# Altium project HGD_MCU(v0.1)-20200807.PrjPcb
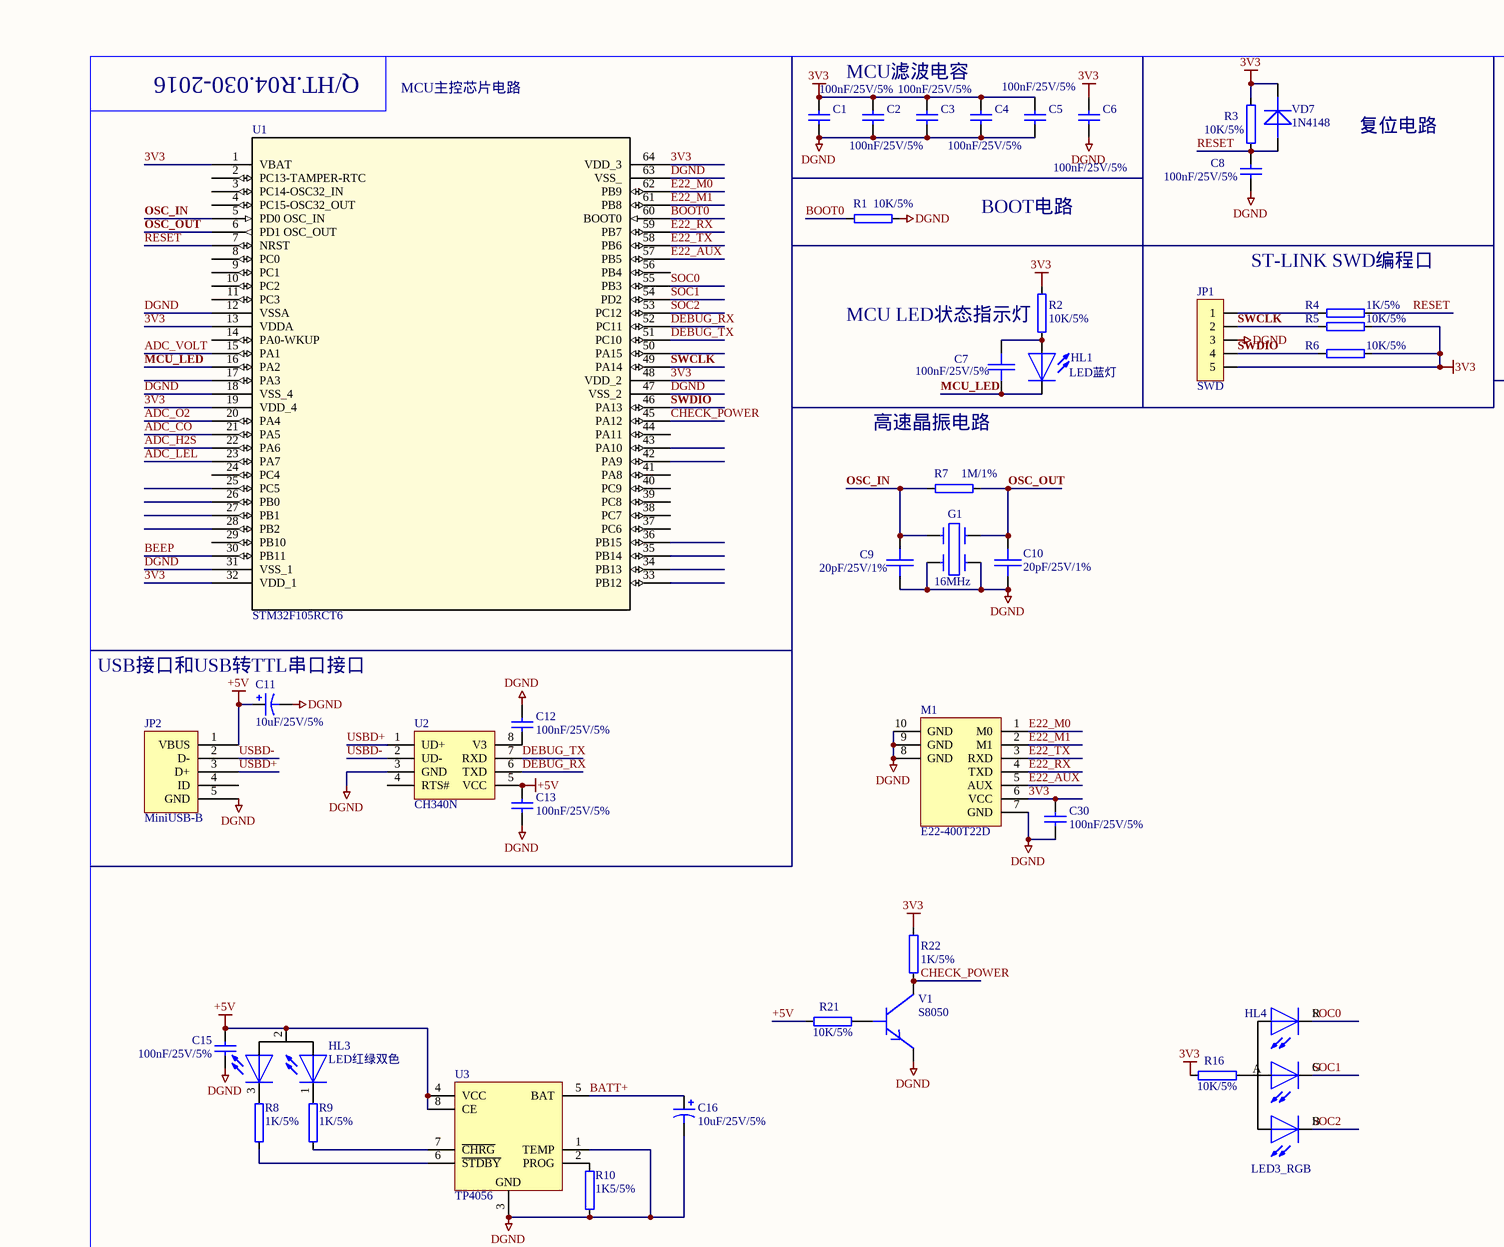
[diagram p0: HGD_MCU(v0.1)-20200807.SchDoc, top left]
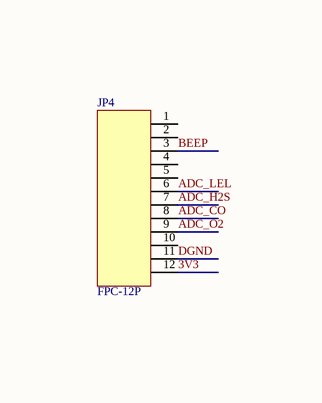
[diagram p1: HGD_MCU(v0.1)-20200807.SchDoc, top right]
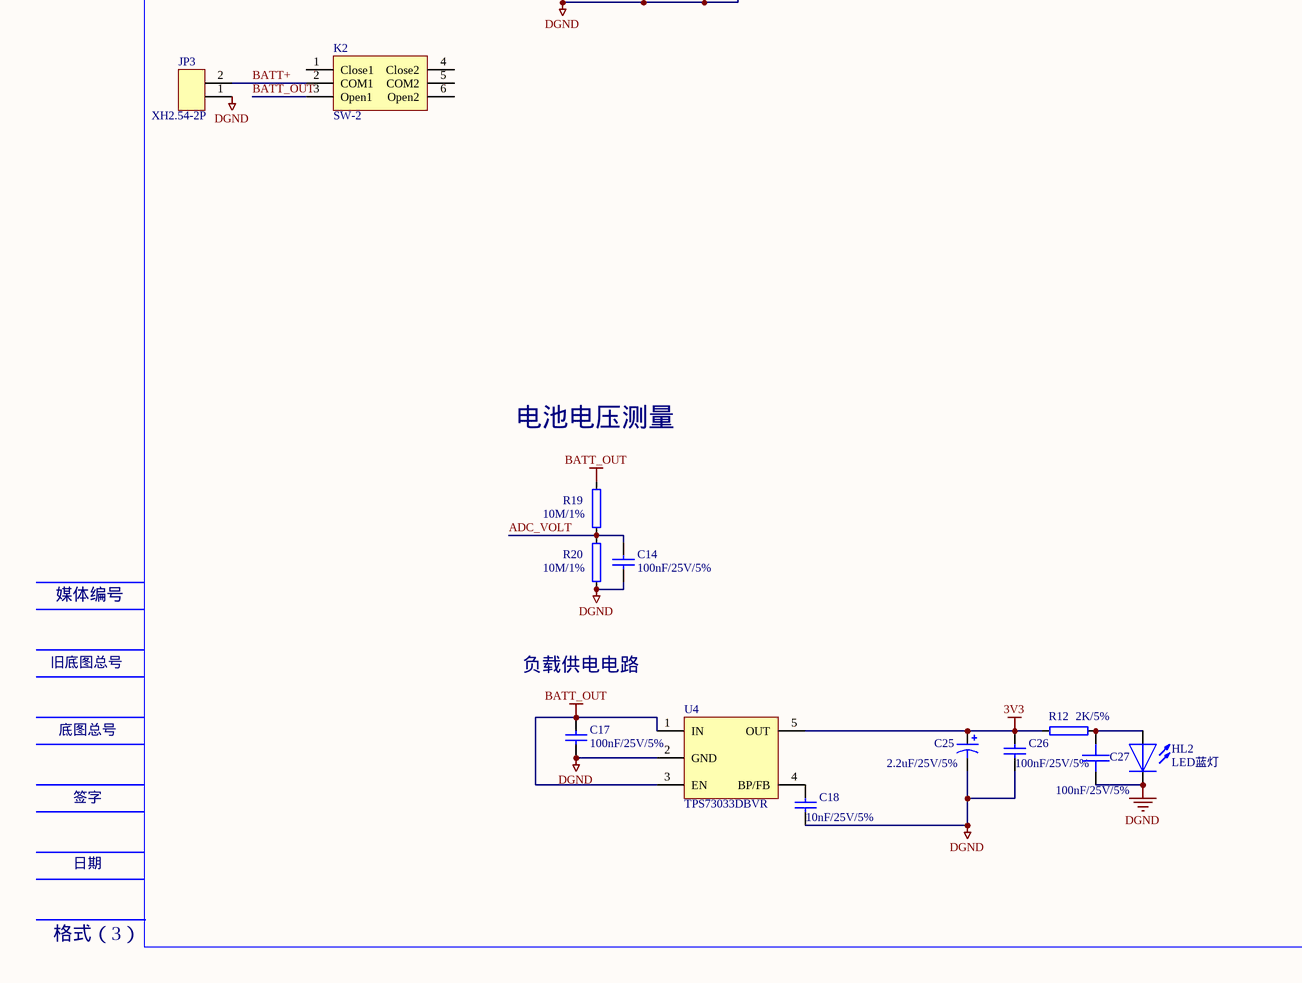
[diagram p2: HGD_MCU(v0.1)-20200807.SchDoc, bottom left]
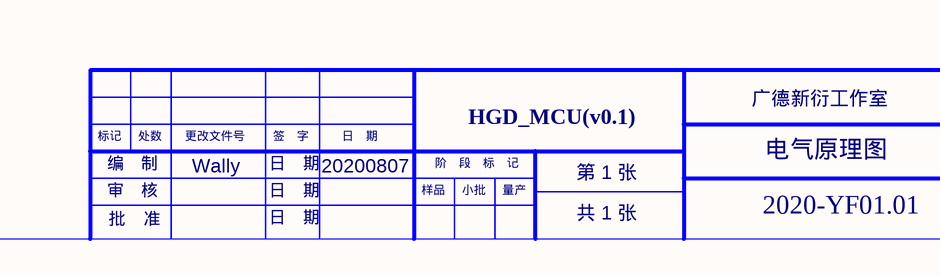
[diagram p3: HGD_MCU(v0.1)-20200807.SchDoc, bottom right]
1 sheet, 55 parts. Net scope: global (net labels, ports and power ports of the same name join across sheets).
Board file: HGD_MCU(v0.1)-20200807.PcbDoc

## Sheet HGD_MCU(v0.1)-20200807.SchDoc
size A2; SheetNumber: 0; SheetTotal: 0; PageSetup: Record=PageOptions|CenterHorizontal=True|CenterVertical=True|PrintScale=0.71|XCorrection=1.00|YCorrection=1.00|PrintKind=2|BorderSize=5000000|LeftOffset=0|BottomOffset=0|Orientation=2|PaperLength=1000|PaperWidth=1000|Scale=100|PaperSource=7|PrintQuality=-4|MediaType=1|DitherType=10|PaperKind=A3|PrintScaleMode=1

### Parts
C1  100nF/25V/5%  [C0603]
C2  100nF/25V/5%  [C0603]
C3  100nF/25V/5%  [C0603]
C4  100nF/25V/5%  [C0603]
C5  100nF/25V/5%  [C0603]
C6  100nF/25V/5%  [C0603]
C7  100nF/25V/5%  [C0603]
C8  100nF/25V/5%  [C0603]
C9  20pF/25V/1%  [C0603]
C10  20pF/25V/1%  [C0603]
C11  10uF/25V/5%  [C1206-1]
C12  100nF/25V/5%  [C0603]
C13  100nF/25V/5%  [C0603]
C14  100nF/25V/5%  [C0603]
C15  100nF/25V/5%  [C0603]
C16  10uF/25V/5%  [C1206-1]
C17  100nF/25V/5%  [C0603]
C18  10nF/25V/5%  [C0603]
C25  2.2uF/25V/5%  [C1206-1]
C26  100nF/25V/5%  [C0603]
C27  100nF/25V/5%  [C0603]
C30  100nF/25V/5%  [C0603]
G1  16MHz  [OSC5032]
HL1  LED蓝灯  [LED0603]
HL2  LED蓝灯  [LED0603]
HL3  LED红绿双色  [LED2_Common_Anode]
HL4  LED3_RGB  [LED3_Common_Anode]
JP1  SWD  [XH2.54-5AW]
JP2  MiniUSB-B  [MiniUSB-B]
JP3  XH2.54-2P  [XH2.54-2AW]
JP4  FPC-12P  [FPC-1.0MM-12P-W]
K2  SW-2  [BTN-7*7]
M1  E22-400T22D  [E22-400T22D]
R1  10K/5%  [R0603]
R2  10K/5%  [R0603]
R3  10K/5%  [R0603]
R4  1K/5%  [R0603]
R5  10K/5%  [R0603]
R6  10K/5%  [R0603]
R7  1M/1%  [R0603]
R8  1K/5%  [R0603]
R9  1K/5%  [R0603]
R10  1K5/5%  [R0603]
R12  2K/5%  [R0603]
R16  10K/5%  [R0603]
R19  10M/1%  [R0603]
R20  10M/1%  [R0603]
R21  10K/5%  [R0603]
R22  1K/5%  [R0603]
U1  STM32F105RCT6  [LQFP64_STM32F105R]
U2  CH340N  [CH340N_SOP8]
U3  TP4056  [TP4056_SOP8_SOP127P600X175-8N]
U4  TPS73033DBVR  [SGM2019_SOT23-5_95P280X125-5N]
V1  S8050  [SOT-23]
VD7  1N4148  [LL-34]

### Nets
3V3: C1.2 C2.1 C3.1 C4.2 C5.2 C6.2 C25.1 C26.2 C30.2 JP1.5 JP4.12 M1.6(VCC) R2.1 R3.2 R5.2 R6.2 R12.1 R16.1 R22.1 U1.1(VBAT) U1.13(VDDA) U1.19(VDD_4) U1.32(VDD_1) U1.48(VDD_2) U1.64(VDD_3) U4.5(OUT) VD7.K
+5V: C11.1 C13.1 C15.1 HL3.2(A) JP2.1(VBUS) R21.2 U2.5(VCC) U3.4(VCC) U3.8(CE)
BATT_OUT: C17.1 K2.3(Open1) R19.1 U4.1(IN) U4.3(EN)
DGND: C1.1 C2.2 C3.2 C4.1 C5.1 C6.1 C8.2 C9.1 C10.2 C11.2 C12.1 C13.2 C14.2 C15.2 C16.2 C17.2 C18.1 C25.2 C26.1 C27.2 C30.1 G1.2 G1.4 HL2.K JP1.3 JP2.5(GND) JP3.1 JP4.11 M1.7(GND) M1.8(GND) M1.9(GND) M1.10(GND) R1.1 R10.1 R20.2 U1.12(VSSA) U1.18(VSS_4) U1.31(VSS_1) U1.47(VSS_2) U1.63(VSS_) U2.3(GND) U3.1(TEMP) U3.3(GND) U4.2(GND) V1.E
ADC_CO: JP4.8 U1.21(PA5)
ADC_H2S: JP4.7 U1.22(PA6)
ADC_LEL: JP4.6 U1.23(PA7)
ADC_O2: JP4.9 U1.20(PA4)
ADC_VOLT: C14.1 R19.2 R20.1 U1.15(PA1)
BATT+: C16.1 JP3.2 K2.2(COM1) U3.5(BAT)
BEEP: JP4.3 U1.30(PB11)
BOOT0: R1.2 U1.60(BOOT0)
CHECK_POWER: R22.2 U1.45(PA12) V1.C
DEBUG_RX: U1.52(PC11) U2.6(TXD)
DEBUG_TX: U1.51(PC10) U2.7(RXD)
E22_AUX: M1.5(AUX) U1.57(PB5)
E22_M0: M1.1(M0) U1.62(PB9)
E22_M1: M1.2(M1) U1.61(PB8)
E22_RX: M1.4(TXD) U1.59(PB7)
E22_TX: M1.3(RXD) U1.58(PB6)
MCU_LED: C7.2 HL1.K U1.16(PA2)
OSC_IN: C9.2 G1.1 R7.1 U1.5(PD0_OSC_IN)
OSC_OUT: C10.1 G1.3 R7.2 U1.6(PD1_OSC_OUT)
RESET: C8.1 R3.1 R4.2 U1.7(NRST) VD7.A
SOC0: HL4.1(R) U1.55(PB3)
SOC1: HL4.3(G) U1.54(PD2)
SOC2: HL4.4(B) U1.53(PC12)
SWCLK: JP1.2 R5.1 U1.49(PA14)
SWDIO: JP1.4 R6.1 U1.46(PA13)
USBD+: JP2.3(D+) U2.1(UD+)
USBD-: JP2.2(D-) U2.2(UD-)
NetC7_1: C7.1 HL1.A R2.2
NetC12_2: C12.2 U2.8(V3)
NetC18_2: C18.2 U4.4(BP/FB)
NetC27_1: C27.1 HL2.A R12.2
NetHL3_1: HL3.1(K1) R9.2
NetHL3_3: HL3.3(K2) R8.2
NetHL4_2: HL4.2(A) R16.2
NetJP1_1: JP1.1 R4.1
NetR8_1: R8.1 U3.6(~{STDBY})
NetR9_1: R9.1 U3.7(~{CHRG})
NetR10_2: R10.2 U3.2(PROG)
NetR21_1: R21.1 V1.B

Not connected (* = marked no-connect by the designer): JP2 4(ID); JP4 1 2 4 5 10; K2 1(Close1) 4(Close2) 5(COM2) 6(Open2); U1 2(PC13-TAMPER-RTC) 3(PC14-OSC32_IN) 4(PC15-OSC32_OUT) 8(PC0) 9(PC1) 10(PC2) 11(PC3) 14(PA0-WKUP) 17(PA3) 24(PC4) 25(PC5) 26(PB0) 27(PB1) 28(PB2) 29(PB10) 33(PB12) 34(PB13) 35(PB14) 36(PB15) 37(PC6) 38(PC7) 39(PC8) 40(PC9) 41(PA8) 42(PA9) 43(PA10) 44(PA11) 50(PA15) 56(PB4); U2 4(RTS#)

### Notes on the sheet
- Q/HT.R04.030-2016
- MCU主控芯片电路
- MCU滤波电容
- 复位电路
- BOOT电路
- ST-LINK SWD编程口
- (near C7) MCU LED状态指示灯
- 高速晶振电路
- (near C11) USB接口和USB转TTL串口接口
- 电池电压测量
- 媒体编号
- 旧底图总号
- 负载供电电路
- 底图总号
- 签字
- HGD_MCU(v0.1)
- 广德新衍工作室
- 日期
- 标记
- 编　制
- 审　核
- 处数
- 更改文件号
- Wally
- 日　期
- 签　字
- 20200807
- 样品
- 阶　段　标　记
- 小批
- 量产
- 第 1 张
- 电气原理图
- 格式（3）
- 批    准
- 共 1 张
- 2020-YF01.01

### Library data of the parts
C1-C6 C8 = CAP-SMD: 电容
C7 C9 C10 C27 = CAP: 电容
C11 C16 = Cap Pol1: 钽电容; Published: 8-Jun-2000; LatestRevisionDate: 17-Jul-2002; LatestRevisionNote: Re-released for DXP Platform.; PackageReference: RB7.6-15; Publisher: Altium Limited; Value: 10uF/25V/5%
C12 C13 C15 C26 C30 = Cap: 电容; Published: 8-Jun-2000; LatestRevisionDate: 17-Jul-2002; LatestRevisionNote: Re-released for DXP Platform.; PackageReference: RAD-0.3; Publisher: Altium Limited; Value: 100nF/25V/5%
C14 C17 = CAP-SMD
C18 = Cap: 电容; Value: 100nF/25V/5%; Published: 8-Jun-2000; LatestRevisionDate: 17-Jul-2002; LatestRevisionNote: Re-released for DXP Platform.; PackageReference: RAD-0.3; Publisher: Altium Limited
C25 = Cap Pol1: 钽电容; Value: 10uF/25V/5%; Published: 8-Jun-2000; LatestRevisionDate: 17-Jul-2002; LatestRevisionNote: Re-released for DXP Platform.; PackageReference: RB7.6-15; Publisher: Altium Limited
G1 = CRYSTAL_4: 两对电极压电晶体
HL1 HL2 = 发光二极管
HL3 = LED2_Common_Anode: LED2_Common_Anode：双色LED，共阳极
HL4 = LED3_Common_Anode: LED3_Common_Anode：三色共阳极LED
JP1 = JP_XH2.54-5AW: XH2.54-5P直插插针
JP2 = MiniUSB-B: MiniUSB-B母头插座
JP3 = XH2.54-2AW: XH2.54-2P弯针插座
K2 = SW-2: SW-2：2通道自锁开关
M1 = E22-400T22D: E22-400T22D LoRa模块
R1-R10 R12 R16 R19-R22 = RES2: 电阻
U4 = SGM2019: SGM2019：Low Power, Low Dropout, RF Linear Regulators
V1 = NPN: NPN三极管
VD7 = 开关二极管